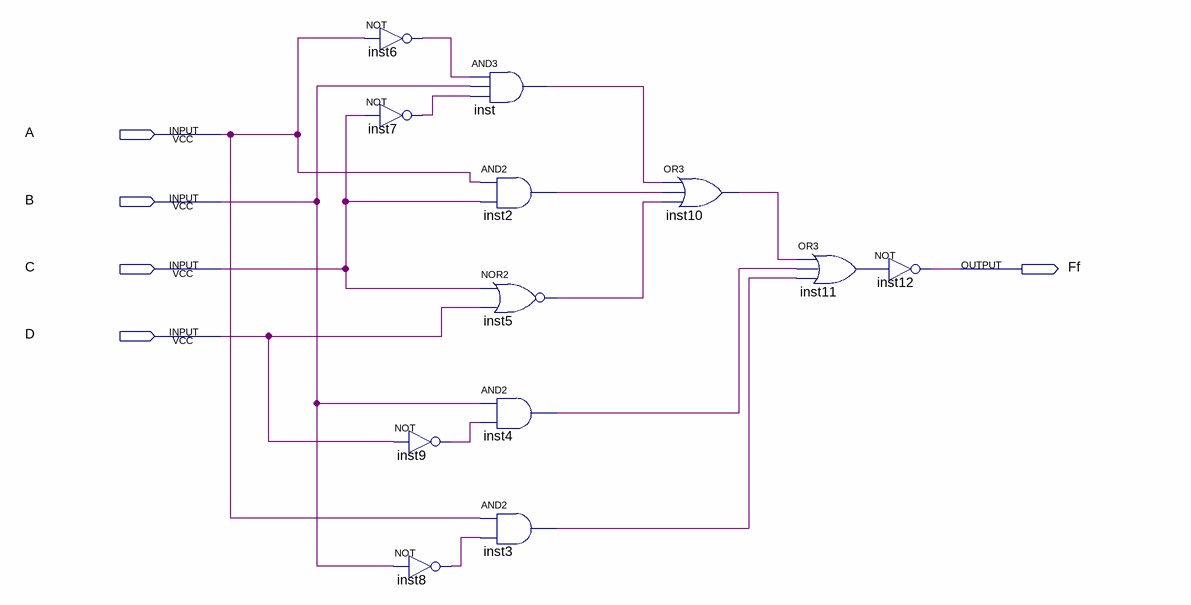
[diagram p0: schematic sheet]
// Quartus schematic ff.bdf as structural Verilog: 12 symbols, 5 pins
module ff (
  input  A,
  input  B,
  input  C,
  input  D,
  output Ff
);

  wire inst2_out, inst3_out, inst4_out, inst5_out, inst6_out, inst7_out, inst8_out, inst9_out, inst10_out,
       inst11_out, inst_out;

  not inst6 (inst6_out, A);
  not inst7 (inst7_out, C);
  not inst9 (inst9_out, D);
  not inst8 (inst8_out, B);
  and inst (inst_out, inst6_out, B, inst7_out);
  and inst2 (inst2_out, A, C);
  nor inst5 (inst5_out, C, D);
  and inst4 (inst4_out, B, inst9_out);
  and inst3 (inst3_out, A, inst8_out);
  or inst10 (inst10_out, inst_out, inst2_out, inst5_out);
  or inst11 (inst11_out, inst10_out, inst4_out, inst3_out);
  not inst12 (Ff, inst11_out);
endmodule
